# EAGLE design riffle-base-simple-DS3231 (EAGLE 6.5.0)
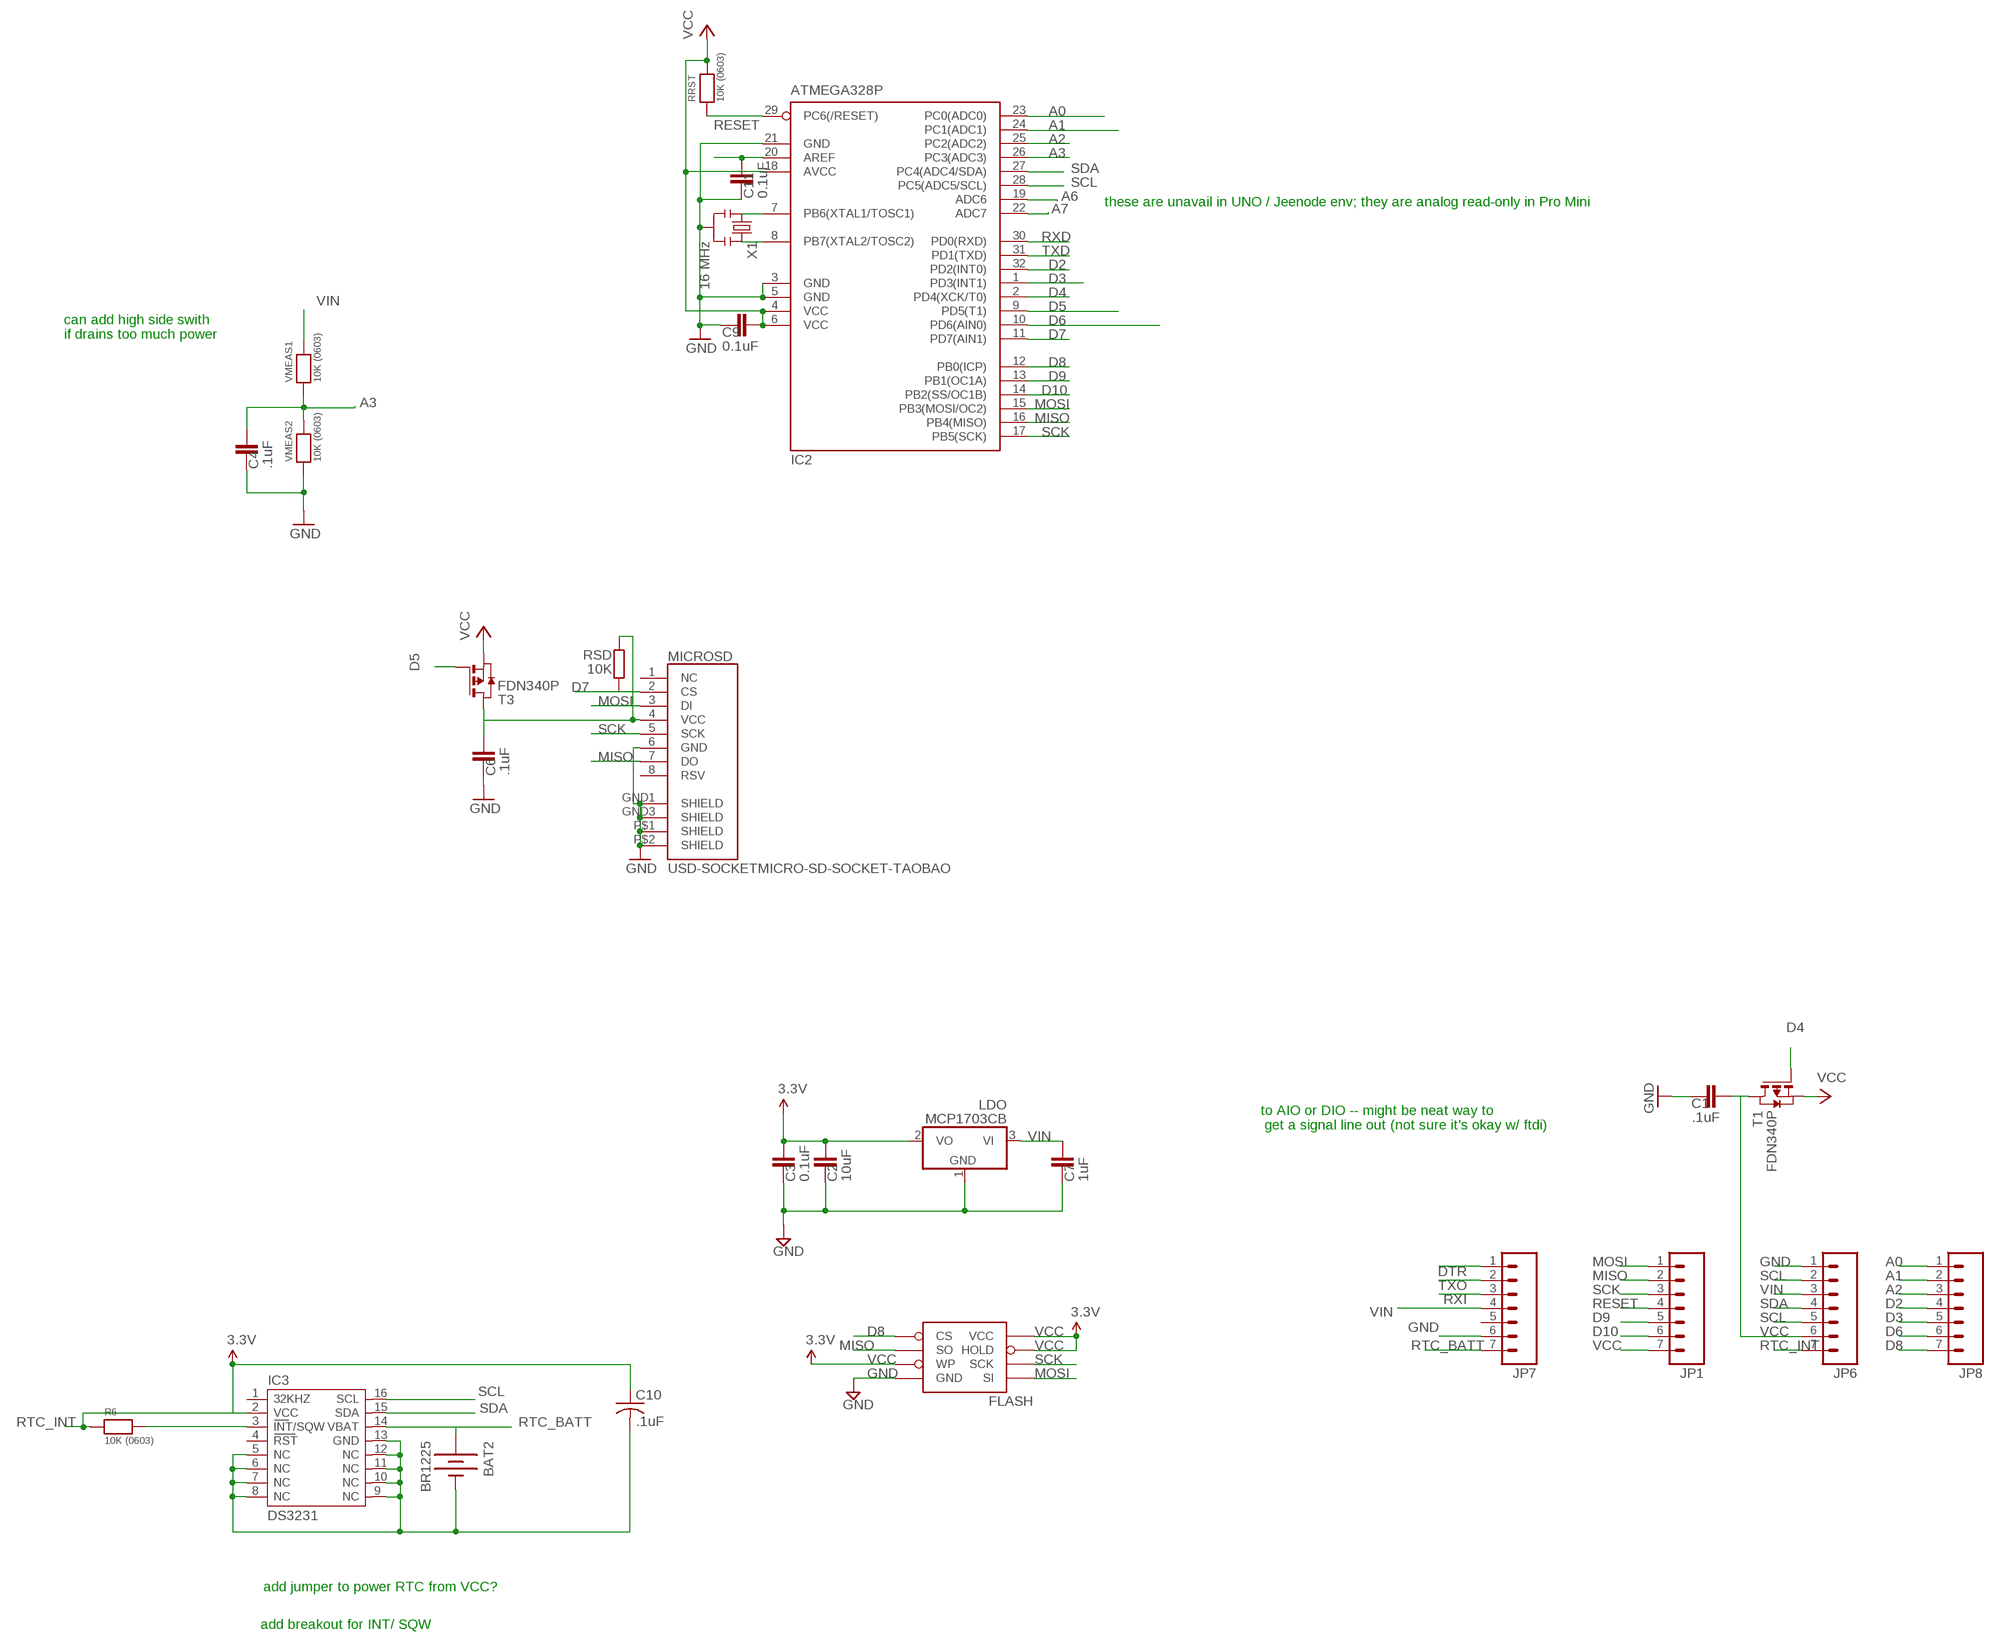
[diagram p0: schematic, sheet 1]

## Parts
BAT2  BR1225  BATTERY12PTH  [BATTCON_12MM_PTH]
C1  .1uF  C-EUC0805  [C0805@1]
C2  10uF  C-EUC0805  [C0805@1]
C3  0.1uF  C-EUC0805  [C0805@1]
C4  .1uF  C-EUC0805  [C0805@1]
C6  .1uF  C-EUC0805  [C0805@1]
C7  1uF  C-EUC0805  [C0805@1]
C9  0.1uF  C-EUC0805  [C0805@1]
C10  .1uF  C-USC0805  [C0805]
C11  0.1uF  C-EUC0805  [C0805@1]
FLASH  AT25F512BWIDE_5.3MM  [SO08WIDE]
IC2  ATMEGA328P  MEGA8-AI  [TQFP32-08]
IC3  DS3231  [DS3231]
JP1  M07  [1X07]
JP6  M07  [1X07]
JP7  M07  [1X07]
JP8  M07  [1X07]
LDO  MCP1703CB  [SOT23]
MICROSD  USD-SOCKETMICRO-SD-SOCKET-TAOBAO  [MICRO-SD-SOCKET-TAOBAO]
R6  10K (0603)  RESISTOR_0603_NOOUT  [0603-NO]
RRST  10K (0603)  RESISTOR_0603_NOOUT  [0603-NO]
RSD  10K  R-EU_R0805  [R0805]
T1  FDN340P  PMOSSOT23  [SOT-23]
T3  FDN340P  PMOSSOT23  [SOT-23]
VMEAS1  10K (0603)  RESISTOR_0603_NOOUT  [0603-NO]
VMEAS2  10K (0603)  RESISTOR_0603_NOOUT  [0603-NO]
X1  16 MHz  RESONATORSMD  [RESONATOR-SMD]

## Nets
A0: IC2.23(PC0(ADC0)) JP8.1
A1: IC2.24(PC1(ADC1)) JP8.2
A2: IC2.25(PC2(ADC2)) JP8.3
A3: C4.2 IC2.26(PC3(ADC3)) VMEAS1.1 VMEAS2.2
A6: IC2.19(ADC6)
A7: IC2.22(ADC7)
AREF: C11.2 IC2.20(AREF)
D2: IC2.32(PD2(INT0)) JP8.4
D3: IC2.1(PD3(INT1)) JP8.5
D4: IC2.2(PD4(XCK/T0)) T1.3(G)
D5: IC2.9(PD5(T1)) T3.3(G)
D6: IC2.10(PD6(AIN0)) JP8.6
D7: IC2.11(PD7(AIN1)) MICROSD.2(CS) RSD.1
D8: FLASH.1(CS) IC2.12(PB0(ICP)) JP8.7
D9: IC2.13(PB1(OC1A)) JP1.5
D10: IC2.14(PB2(SS/OC1B)) JP1.6
DTR: JP7.1
GND [power]: BAT2.GND(-) C1.1 C2.1 C3.1 C4.1 C6.1 C7.1 C9.1 C10.2 C11.1 FLASH.4(GND) IC2.3(GND) IC2.5(GND) IC2.21(GND) IC3.5(NC) IC3.6(NC) IC3.7(NC) IC3.8(NC) IC3.9(NC) IC3.10(NC) IC3.11(NC) IC3.12(NC) IC3.13(GND) JP6.1 JP7.6 LDO.1(GND) MICROSD.6(GND) MICROSD.GND1(SHIELD) MICROSD.GND3(SHIELD) MICROSD.P$1(SHIELD) MICROSD.P$2(SHIELD) VMEAS2.1 X1.2
MISO: FLASH.2(SO) IC2.16(PB4(MISO)) JP1.2 MICROSD.7(DO)
MOSI: FLASH.5(SI) IC2.15(PB3(MOSI/OC2)) JP1.1 MICROSD.3(DI)
N$2: IC2.8(PB7(XTAL2/TOSC2)) X1.3
N$5: IC2.7(PB6(XTAL1/TOSC1)) X1.1
N$16: IC3.3(INT/SQW) R6.2
N$31: C6.2 MICROSD.4(VCC) RSD.2 T3.1(D)
RESET: IC2.29(PC6(/RESET)) JP1.4 RRST.1
RTC_BATT: BAT2.VCC@1(+) IC3.14(VBAT) JP7.7
RTC_INT: C10.1 IC3.2(VCC) JP6.7 R6.1 ; supply symbol labelled 3.3V
RXD: IC2.30(PD0(RXD))
RXI: JP7.3
SCK: FLASH.6(SCK) IC2.17(PB5(SCK)) JP1.3 MICROSD.5(SCK)
SCL: IC2.28(PC5(ADC5/SCL)) IC3.16(SCL) JP6.2 JP6.5
SDA: IC2.27(PC4(ADC4/SDA)) IC3.15(SDA) JP6.4
TXD: IC2.31(PD1(TXD))
TXO: JP7.2
VCC: C1.2 C2.2 C3.2 C9.2 FLASH.3(WP) FLASH.7(HOLD) FLASH.8(VCC) IC2.4(VCC) IC2.6(VCC) IC2.18(AVCC) JP1.7 JP6.6 LDO.2(VO) RRST.2 T1.1(D) T1.2(S) T3.2(S) ; supply symbol labelled 3.3V
VIN [power]: C7.2 JP6.3 JP7.4 LDO.3(VI) VMEAS1.2
Unconnected: IC3.1(32KHZ) IC3.4(RST) JP7.5 MICROSD.1(NC) MICROSD.8(RSV)

## Notes on the sheet
- these are unavail in UNO / Jeenode env; they are analog read-only in Pro Mini
- can add high side swith
  if drains too much power
- to AIO or DIO -- might be neat way to
   get a signal line out (not sure it's okay w/ ftdi)
- add jumper to power RTC from VCC?
- add breakout for INT/ SQW

## Library data of the parts
BAT2 = SparkFun:BATTERY: Battery Holders Various common sizes : AA, AAA, 20mm coin cell and 12mm coin cell.
C1-C4 C6 C7 C9 C11 = rcl:C-EU: CAPACITOR, European symbol
C10 = rcl:C-US: CAPACITOR, American symbol
FLASH = LowPowerLab:AT25F512B: 4-Mbit SPI flash memory
IC2 = atmel:MEGA8: MICROCONTROLLER 8 Kbytes FLASH, 1 kbytes SRAM, 512 bytes EEPROM, USART, 6-channel 10 bit ADC, 2-channel 8 bit ADC Pin compatible with Atmega48, ATMega88, ATMega168 Source: avr.lbr; MPN: ATMEGA8-16AU; OC_FARNELL: 9171371; OC_NEWARK: 73M8863
IC3 = _lh-library:DS3231
JP1 JP6-JP8 = SparkFun-Connectors:M07: Header 7 Standard 7-pin 0.1" header. Use with straight break away headers (SKU : PRT-00116), right angle break away headers (PRT-00553), swiss pins (PRT-00743), machine pins (PRT-00117), and female headers (PRT-00115). NOTES ON THE VARIANTS LOCK and LOCK_LONGPADS... This footprint was designed to help hold the alignment of a through-hole component (i.e. 7-pin header) while soldering it into place. You may notice that each hole has been shifted either up or down by 0.005 of an inch from it's more standard position (which is usually a perfectly straight line). This slight alteration caused the pins (the squares in the middle) to touch the edges of the holes. Because they are alternating, it causes a "brace" to hold the header in place. 0.005 has proven to be the perfect amount of "off-center" position when using our standard breakaway headers. Although looks a little odd when you look at the bare footprint, once you have a header in there, the alteration is very hard to notice. Also, if you push a header all the way into place, it is covered up entirely on the bottom side. This idea of altering the position of holes to aid alignment will be further integrated into the Sparkfun Library for other footprints. It can help hold any component with 3 or more connection pins.
LDO = linear:MCP1703: 250 mA, 16V, Low Quiescent Current LDO Regulator Source: http://ww1.microchip.com/downloads/en/DeviceDoc/22049b.pdf
MICROSD = SparkFunNew:USD-SOCKET: microSD Socket Push-push type uSD socket. Schematic element and footprint production proven. Spark Fun Electronics SKU : PRT-00127. tDoc lines correctly indicate media card edge positions when inserting (unlocked, locked, depressed).
R6 RRST VMEAS1 VMEAS2 = microbuilder:RESISTOR: Resistors For new designs, use the packages preceded by an '_' character since they are more reliable: The following footprints should be used on most boards: _0402 - Standard footprint for regular board layouts _0603 - Standard footprint for regular board layouts _0805 - Standard footprint for regular board layouts For extremely tight-pitch boards where space is at a premium, the following 'micro-pitch' footprints can be used (smaller pads, no silkscreen outline, etc.): _0402MP - Micro-pitch footprint for very dense/compact boards _0603MP - Micro-pitch footprint for very dense/compact boards _0805MP - Micro-pitch footprint for very dense/compact boards
RSD = rcl:R-EU_: RESISTOR, European symbol
T1 T3 = zetex:PMOSSOT23: MOS FET
X1 = SparkFun:RESONATOR: Resonator Small SMD resonator. This is the itty bitty 10/20MHz resonators with built in caps. CSTCE10M0G55 and CSTCE20M0V53. Footprint has been reviewed closely but hasn't been tested yet.

## Net classes
1 power: width 0.381 mm, clearance 0.254 mm

## Board
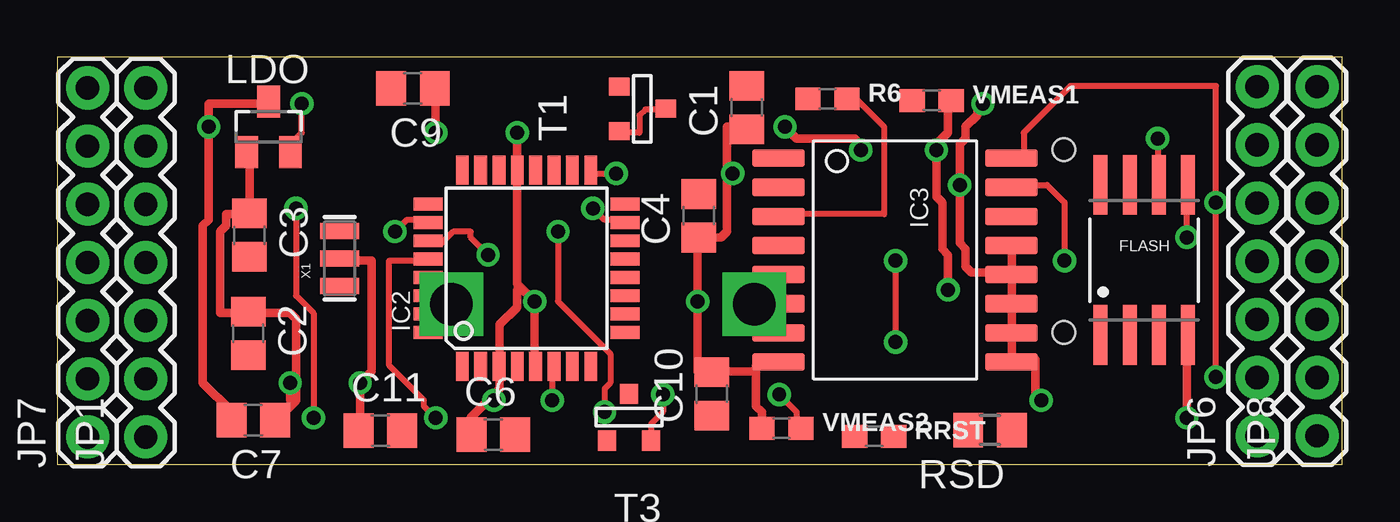
[diagram p1: board, top side]
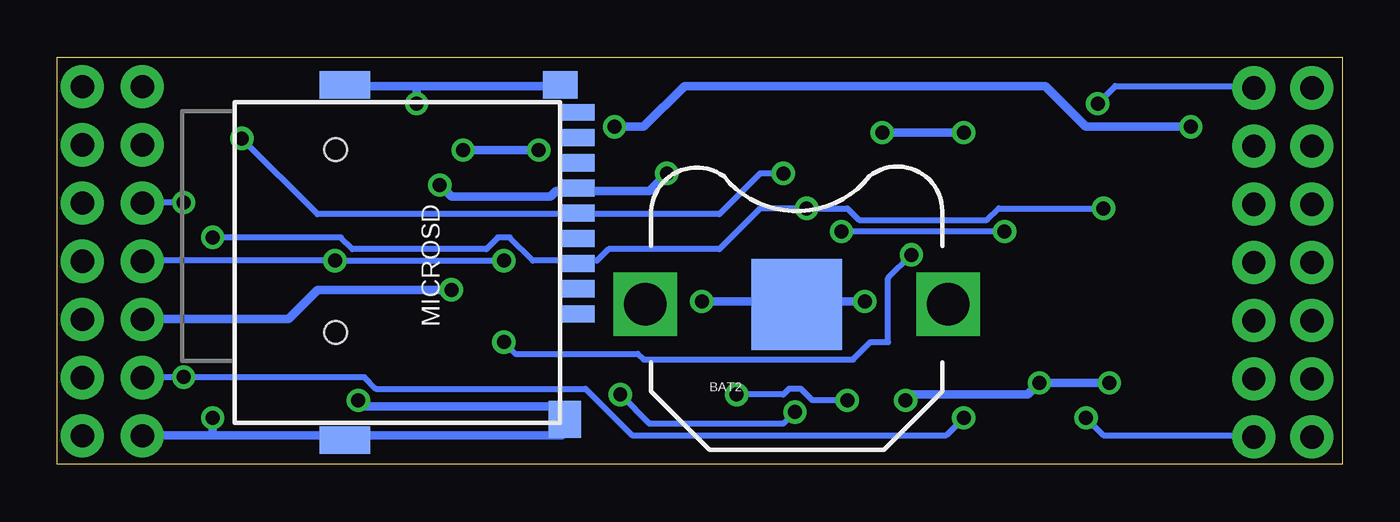
[diagram p2: board, bottom side, seen from below]

Size 56.06 x 17.77 mm. Coordinates in mm from the lower left corner, seen from the top.
Outline: 0,0 56.06,0 56.06,17.77 0,17.77 0,0
Copper layers (1*16): Top 0.035mm / dielectric 1.5mm / Bottom 0.035mm
Design rules "default": minimum track width 10mil, minimum drill 24mil, track to track 8mil, track to pad 8mil, pad to pad 8mil, via to via 8mil, smd to smd 8mil, copper to edge 40mil, drill to drill 8mil, minimum pad ring 10mil, minimum via ring 8mil, stop-mask expansion 4mil, vias tented up to drill 0mil, thermal gap 10mil

### Footprints (pad centres in the part's own frame; a part is rotated, then mirrored left to right if it is on the bottom)
BATTCON_12MM_PTH = smd 3.962 x 3.962: GND 0,0 | drill 1.854 square: VCC@1 -6.604,0; VCC@2 6.604,0
C0805@1 = smd 1.3 x 1.5: 1 -0.95,0; 2 0.95,0
C0805 = smd 1.3 x 1.5: 1 -0.95,0; 2 0.95,0
SO08WIDE = smd 0.61 x 2.6: 1 -1.905,-3.269; 2 -0.635,-3.269; 3 0.635,-3.269; 4 1.905,-3.269; 5 1.905,3.286; 6 0.635,3.286; 7 -0.635,3.286; 8 -1.905,3.286
TQFP32-08 = smd 1.27 x 0.559: 1 -4.293,2.8; 2 -4.293,2; 3 -4.293,1.2; 4 -4.293,0.4; 5 -4.293,-0.4; 6 -4.293,-1.2; 7 -4.293,-2; 8 -4.293,-2.8; 17 4.293,-2.8; 18 4.293,-2; 19 4.293,-1.2; 20 4.293,-0.4; 21 4.293,0.4; 22 4.293,1.2; 23 4.293,2; 24 4.293,2.8 | smd 0.559 x 1.27: 9 -2.8,-4.293; 10 -2,-4.293; 11 -1.2,-4.293; 12 -0.4,-4.293; 13 0.4,-4.293; 14 1.2,-4.293; 15 2,-4.293; 16 2.8,-4.293; 25 2.8,4.293; 26 2,4.293; 27 1.2,4.293; 28 0.4,4.293; 29 -0.4,4.293; 30 -1.2,4.293; 31 -2,4.293; 32 -2.8,4.293
DS3231 = smd 0.762 x 2.286: 1 -4.445,-5.08; 2 -3.175,-5.08; 3 -1.905,-5.08; 4 -0.635,-5.08; 5 0.635,-5.08; 6 1.905,-5.08; 7 3.175,-5.08; 8 4.445,-5.08; 9 4.445,5.08; 10 3.175,5.08; 11 1.905,5.08; 12 0.635,5.08; 13 -0.635,5.08; 14 -1.905,5.08; 15 -3.175,5.08; 16 -4.445,5.08
1X07 = drill 1.016 pad 1.88: 1 0,0; 2 2.54,0; 3 5.08,0; 4 7.62,0; 5 10.16,0; 6 12.7,0; 7 15.24,0
SOT23 = smd 1 x 1.4: 1 -0.95,-1.1; 2 0.95,-1.1; 3 0,1.1
MICRO-SD-SOCKET-TAOBAO = smd 0.75 x 1.6: 1 2.25,10.5; 2 1.15,10.5; 3 0.05,10.5; 4 -1.05,10.5; 5 -2.15,10.5; 6 -3.25,10.5; 7 -4.35,10.5; 8 -5.45,10.5 | smd 0.7 x 1.6: CD -6.55,10.5 | smd 1.2 x 1.5: GND1 -7.75,9.8 | smd 1.6 x 1.4: GND3 6.85,10 | smd 1.2 x 2.2: P$1 7.75,0.4; P$2 -7.75,0.4 | hole 1: 3.05,0; -4.93,0
0603-NO = smd 1.1 x 1: 1 -0.85,0; 2 0.85,0
R0805 = smd 1.3 x 1.5: 1 -0.95,0; 2 0.95,0
SOT-23 = smd 0.787 x 0.889: 1 0.025,-1.016; 2 -0.94,1.016; 3 0.991,1.016
RESONATOR-SMD = smd 0.7 x 1.7: 1 -1.2,0; 2 0,0; 3 1.2,0

### Placement (x,y rotation side)
BAT2  23.8,6.99 0 bottom
C1  30.07,15.57 90 top
C2  8.33,5.71 270 top
C3  8.38,10.01 270 top
C4  27.99,10.85 90 top
C6  19.02,1.3 0 top
C7  8.56,1.93 180 top
C9  15.52,16.41 180 top
C10  28.55,3.07 90 top
C11  14.1,1.47 0 top
FLASH  47.42,8.92 0 top
IC2  20.47,8.56 90 top
IC3  36.55,8.92 270 top
JP1  3.86,1.19 90 top
JP6  52.35,1.24 90 top
JP7  1.32,1.19 90 top
JP8  54.97,1.24 90 top
LDO  9.22,14.73 0 top
MICROSD  43.92,8.81 270 bottom
R6  33.6,15.95 0 top
RRST  35.64,1.22 0 top
RSD  40.69,1.5 180 top
T1  25.53,15.49 90 top
T3  24.97,2.06 180 top
VMEAS1  38.15,15.88 0 top
VMEAS2  31.6,1.57 0 top
X1  12.32,8.99 90 top

### Tracks (layer width: path | path; a pad name or v marks a point on that pad's centre or on a via)
A3  (via drill 0.61)
  Top 0.254: v31.5,3.05 32.26,2.29 32.26,1.78 VMEAS2.2 | v23.88,2.29 23.88,3.3 24.13,3.56 24.13,4.83 21.84,7.11 v21.84,10.16 | v14.73,10.16 15.24,10.67 16,10.67 IC2.26
  Bottom 0.254: v31.5,3.05 30.23,1.78 24.38,1.78 v23.88,2.29 | v14.73,10.16 v21.84,10.16
GND  (via drill 0.61)
  Top 0.381: 41.66,4.57 41.66,5.59 IC3.10 41.66,5.84 41.66,6.86 IC3.11 41.66,7.11 41.66,8.13 IC3.12 | IC3.13 41.66,9.4 41.66,8.38 IC3.12 | v49.28,2.03 49.28,5.59 FLASH.4 | 41.66,4.57 42.67,4.57 42.67,3.05 v42.93,2.79 | 41.66,4.57 IC3.9 | v40.39,15.75 40.13,15.49 40.13,15.24 39.62,14.73 39.62,14.22 39.37,13.97 v39.37,12.19 39.37,9.65 39.62,9.4 39.62,8.64 39.88,8.38 41.4,8.38 IC3.12 | 30.48,4.06 30.48,4.32 30.73,4.57 31.24,4.57 IC3.8 | 30.48,4.06 30.48,2.54 30.73,2.29 30.73,1.78 VMEAS2.1 | 29.21,12.7 29.21,10.16 28.96,9.91 28.19,9.91 C4.1 27.94,9.65 v27.94,7.11 27.94,4.06 28.45,4.06 C10.2 28.7,4.06 30.48,4.06 | 29.21,12.7 29.21,14.73 29.97,14.73 C1.1 | 29.21,12.7 v29.46,12.7 | LDO.1 8.38,13.46 C3.1 8.38,10.92 7.37,10.92 7.37,10.41 7.11,10.16 7.11,6.6 8.13,6.6 C2.1 8.38,6.6 10.16,6.6 10.41,6.35 10.41,2.79 10.29,2.67 | 10.29,2.67 9.65,2.03 C7.1 | v10.16,3.56 10.16,2.79 10.29,2.67 | C11.1 13.21,1.52 v13.21,3.56 13.72,4.06 13.72,8.89 12.45,8.89 X1.2 | 18.92,2.92 18.03,2.03 18.03,1.52 C6.1 | 18.92,2.92 19.3,3.3 19.3,4.06 IC2.3 19.3,4.32 19.3,6.1 20.07,6.86 20.07,7.62 20.19,7.75 | IC2.5 20.83,4.32 v20.83,7.11 20.19,7.75 | 20.19,7.75 20.07,7.87 20.07,12.7 IC2.21 20.07,12.95 v20.07,14.48 | v16.51,14.48 16.51,16.26 C9.1 | v19.05,2.79 18.92,2.92
  Bottom 0.381: 40.39,16.51 43.43,16.51 MICROSD.P$2 | 40.39,16.51 34.29,16.51 MICROSD.GND1 | 49.28,1.27 43.69,1.27 MICROSD.P$1 43.43,1.27 34.04,1.27 34.04,1.78 MICROSD.GND3 34.04,2.03 34.04,2.54 42.67,2.54 v42.93,2.79 | 49.28,1.27 52.32,1.27 JP6.1 | 49.28,1.27 v49.28,2.03 | v40.39,15.75 40.39,16.51 | v29.46,12.7 30.23,11.94 33.27,11.94 MICROSD.6 33.53,11.94 34.29,11.94 34.54,11.68 38.86,11.68 v39.37,12.19 | v10.16,3.56 v13.21,3.56 13.72,3.05 18.8,3.05 v19.05,2.79 | v20.83,7.11 23.62,7.11 BAT2.GND 23.88,7.11 v27.94,7.11 | v20.07,14.48 v16.51,14.48
MOSI  (via drill 0.61)
  Top 0.254: v11.18,2.03 11.18,6.6 10.41,7.37 v10.41,11.18 | v23.37,11.18 23.88,10.67 24.64,10.67 IC2.15 | v49.28,9.91 49.28,12.19 FLASH.5
  Bottom 0.254: v11.18,2.03 10.41,1.27 4.06,1.27 JP1.1 | v10.41,11.18 14.99,11.18 15.49,10.67 21.08,10.67 21.59,11.18 v23.37,11.18 25.4,11.18 27.18,9.4 32,9.4 32.51,8.89 33.27,8.89 MICROSD.3 33.53,8.89 35.31,8.89 36.32,9.91 36.83,9.91 37.34,9.4 43.18,9.4 43.69,9.91 v49.28,9.91
N$16
  Top 0.254: IC3.3 31.5,10.92 36.07,10.92 36.07,14.73 34.8,16 34.54,16 R6.2
SCK  (via drill 0.61)
  Top 0.254: v24.38,12.7 23.37,12.7 IC2.17 | v48.01,14.22 48.01,12.45 FLASH.6
  Bottom 0.254: v24.38,12.7 25.4,12.7 27.18,10.92 33.27,10.92 MICROSD.5 33.53,10.92 44.7,10.92 v48.01,14.22
SCL  (via drill 0.61)
  Top 0.254: v50.55,3.81 v50.55,11.43 50.55,16.51 44.2,16.51 42.16,14.48 42.16,13.46 41.66,13.46 IC3.16 | v16.51,2.03 16,2.54 16,2.79 14.48,4.32 14.48,8.89 16,8.89 IC2.28
  Bottom 0.254: v50.55,11.43 52.32,11.43 JP6.5 | JP6.2 52.32,3.81 v50.55,3.81 42.67,3.81 42.16,3.3 33.02,3.3 30.99,1.27 17.27,1.27 v16.51,2.03
SDA  (via drill 0.61)
  Top 0.254: v43.94,8.89 43.94,11.43 43.18,12.19 41.66,12.19 IC3.15 | v18.8,9.14 18.03,9.91 18.03,10.16 17.27,10.16 16.76,9.65 16.26,9.65 IC2.27 | v36.58,8.89 v36.58,5.33
  Bottom 0.254: JP6.4 52.32,8.89 v43.94,8.89 v36.58,8.89 | v18.8,9.14 19.81,8.13 19.81,5.33 20.57,5.33 21.34,4.57 30.48,4.57 30.73,4.83 36.07,4.83 v36.58,5.33
VCC  (via drill 0.61)
  Top 0.254: T1.2 24.64,14.48 25.4,14.48 25.4,15.24 25.65,15.49 26.42,15.49 T1.1 | T3.2 25.91,1.78 26.42,2.29 v26.42,3.05 | v21.59,2.79 21.59,4.06 IC2.6 | v10.67,15.75 10.67,14.48 10.16,13.97 10.16,13.72 LDO.2
  Bottom 0.254: v26.42,3.05 24.38,3.05 24.13,3.3 23.62,3.3 23.11,2.79 v21.59,2.79 | v10.67,15.75 9.91,16.51 4.06,16.51 JP1.7
VIN  (via drill 0.61)
  Top 0.381: LDO.3 9.14,15.75 6.6,15.75 v6.6,14.73 6.6,10.67 6.35,10.41 6.35,3.56 7.62,2.29 7.62,2.03 C7.2 | v38.86,7.62 38.86,9.14 38.61,9.4 38.61,11.43 38.35,11.68 v38.35,13.72 38.35,13.97 38.86,14.48 38.86,15.75 VMEAS1.2 | v31.75,14.73 32.26,14.22 34.8,14.22 35.05,13.97 v35.05,13.72
  Bottom 0.381: v38.86,7.62 44.7,7.62 45.97,6.35 52.32,6.35 JP6.3 | v6.6,14.73 11.18,14.73 12.95,16.51 28.7,16.51 30.48,14.73 v31.75,14.73 | v38.35,13.72 v35.05,13.72